# Altium schematic sheet CH32V007E8R6.SchDoc
size 241 x 248 mm; SheetNumber: 0; SheetTotal: 0
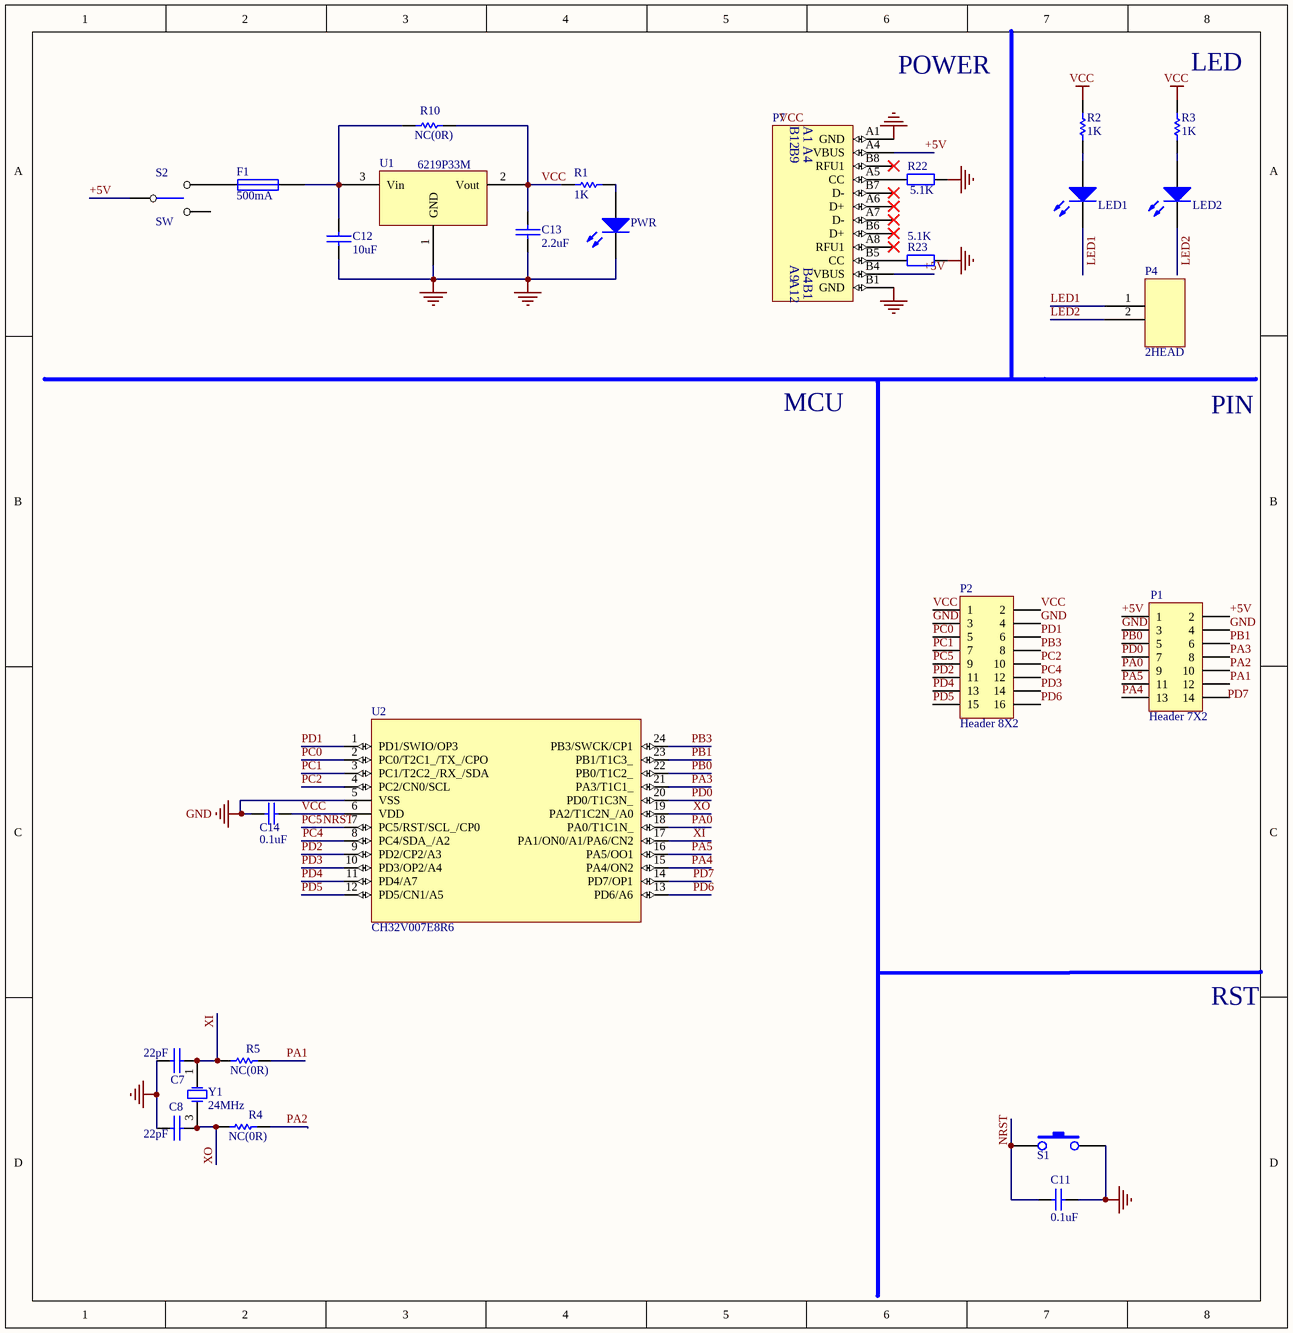
[diagram p0: CH32V007E8R6.SchDoc]

## Parts
C7  22pF  [0402_C]
C8  22pF  [0402_C]
C11  0.1uF  [0402_C]
C12  10uF  [0603_C]
C13  2.2uF  [0402_C]
C14  0.1uF  [0603_C]
F1  500mA  [0603]
LED1  LED1   blue  [0603+]  (value not drawn)
LED2  LED2  blue  [0603+]  (value not drawn)
P1  Header 7X2  [HDR2X7]
P2  Header 8X2  [HDR2X8]
P4  2HEAD  [SIP2-2.54mm]
P7  TYPE-C  [TYPE-C-Receptacle-2.0]  (value not drawn)
PWR  POWER  red  [0603+]  (value not drawn)
R1  1K  [0402]
R2  1K  [0402]
R3  1K  [0402]
R4  value NC(0R)  [0402]  (hidden comment: 0R)
R5  value NC(0R)  [0402]  (hidden comment: 0R)
R10  value NC(0R)  [0402]  (hidden comment: 0R)
R22  5.1K  [0402]
R23  5.1K  [0402]
S1  NRST  [SMD_6.1x3.65x2.5mm-KEY]  (value not drawn)
S2  SW  [SW1]
U1  6219P33M  [SOT-23]
U2  CH32V007E8R6  [QSOP24]
Y1  24MHz  [XT3225]

## Nets
GND: C7.1 C8.1 C11.1 C12.2 C13.1 C14.1 P1.3 P1.4 P2.3 P2.4 P7.A1(GND) P7.B1(GND) PWR.2(K) R22.2 R23.2 S1.2 U1.1(GND) U2.5(VSS)
VCC: C13.2 C14.2 P2.1 P2.2 R1.2 R2.1 R3.1 R10.2 U1.2(Vout) U2.6(VDD)
+5V: P1.1 P1.2 P7.A4(VBUS) P7.B4(VBUS) S2.1
LED1: LED1.2(K) P4.1
LED2: LED2.2(K) P4.2
NRST: C11.2 P2.9 S1.1 U2.7(PC5/RST/SCL_/CP0)  [also labelled PC5]
PA0: P1.9 U2.18(PA0/T1C1N_)
PA1: P1.12 R5.2
PA2: P1.10 R4.2
PA3: P1.8 U2.21(PA3/T1C1_)
PA4: P1.13 U2.15(PA4/ON2)
PA5: P1.11 U2.16(PA5/OO1)
PB0: P1.5 U2.22(PB0/T1C2_)
PB1: P1.6 U2.23(PB1/T1C3_)
PB3: P2.8 U2.24(PB3/SWCK/CP1)
PC0: P2.5 U2.2(PC0/T2C1_/TX_/CPO)
PC1: P2.7 U2.3(PC1/T2C2_/RX_/SDA)
PC2: P2.10 U2.4(PC2/CN0/SCL)
PC4: P2.12 U2.8(PC4/SDA_/A2)
PD0: P1.7 U2.20(PD0/T1C3N_)
PD1: P2.6 U2.1(PD1/SWIO/OP3)
PD2: P2.11 U2.9(PD2/CP2/A3)
PD3: P2.14 U2.10(PD3/OP2/A4)
PD4: P2.13 U2.11(PD4/A7)
PD5: P2.15 U2.12(PD5/CN1/A5)
PD6: P2.16 U2.13(PD6/A6)
PD7: U2.14(PD7/OP1)
XI: C7.2 R5.1 U2.17(PA1/ON0/A1/PA6/CN2) Y1.1(OSC1)
XO: C8.2 R4.1 U2.19(PA2/T1C2N_/A0) Y1.3(OSC2)
NetC12_1: C12.1 F1.2 R10.1 U1.3(Vin)
NetF1_1: F1.1 S2.3
NetLED1_1: LED1.1(A) R2.2
NetLED2_1: LED2.1(A) R3.2
NetP7_A5: P7.A5(CC) R22.1
NetP7_B5: P7.B5(CC) R23.1
NetPWR_1: PWR.1(A) R1.1

Not connected (* = marked no-connect by the designer): P1 14; P7 A6(D+)* A7(D-)* A8(RFU1)* B6(D+)* B7(D-)* B8(RFU1)*; S2 2

## Notes on the sheet
- (near R3) LED
- POWER
- MCU
- PIN
- RST
- Labels drawn without touching a wire or pin: PD7, VCC
- Title
- Size:
- Date:
- A3
- Number:
- Time:
- Revision:
- Sheet
- of
- File:
- (in symbol TYPE-C1) B12; B9; A9; A12

## Library data of the parts
C7 C8 C12 C13 = CAP: Capacitor
C11 = Cap: Capacitor; Published: 8-Jun-2000; LatestRevisionDate: 17-Jul-2002; LatestRevisionNote: Re-released for DXP Platform.; PackageReference: RAD-0.3; Publisher: Altium Limited; Value: 0.1uF
C14 = Cap: Capacitor; Value: 15pF; Published: 8-Jun-2000; LatestRevisionDate: 17-Jul-2002; LatestRevisionNote: Re-released for DXP Platform.; PackageReference: RAD-0.3; Publisher: Altium Limited
F1 = FUSE1: Fuse
LED1 LED2 PWR = LED0: Typical INFRARED GaAs LED; Published: 8-Jun-2000; LatestRevisionDate: 08-Jul-2005; LatestRevisionNote: Mech Layer 1 removed.; PackageReference: LED-0; Publisher: Altium Limited
P1 = Header 7X2: Header, 7-Pin, Dual row; LatestRevisionDate: 17-Jul-2002; LatestRevisionNote: Re-released for DXP Platform.; Publisher: Altium Limited
P2 = Header 8X2: Header, 8-Pin, Dual row; LatestRevisionDate: 17-Jul-2002; LatestRevisionNote: Re-released for DXP Platform.; Publisher: Altium Limited
P7 = TYPE-C1
R1-R5 R10 = Res Semi: Semiconductor Resistor; Published: 8-Jun-2000; LatestRevisionDate: 17-Jul-2002; LatestRevisionNote: Re-released for DXP Platform.; PackageReference: AXIAL-0.5; Publisher: Altium Limited
  R1-R3: Value: 1K
R22 R23 = Res2: Resistor
S1 = KEY
U2 = CH32V007E8R6: RISC-V MCU, ADC/OPA/CMP/2*UART/I2C/SPI
Y1 = XTAL: Crystal Oscillator; Published: 8-Jun-2000; LatestRevisionDate: 17-Jul-2002; LatestRevisionNote: Re-released for DXP Platform.; PackageReference: R38; Publisher: Altium Limited; PackageDescription: Crystal, Thru-Hole; 2 Leads; Body 3.1 x 8.2 mm (Dia.xH)